# EasyEDA Pro project boost_0.8V_to_3.3V_v0.1.eprj

# Schematic Schematic1
Create Date: 2023-07-08; Page Name: P1; Project Name: BuckBoost 1V to 3.3V v0.1; Schematic Name: Schematic1; Update Date: 2023-07-08; Company: EasyEDA.com; Drawed: EasyEDA Pro; Page Size: A4; Part Number: JLCPCB-002; Reviewed: EasyEDA Pro; Version: V0.1
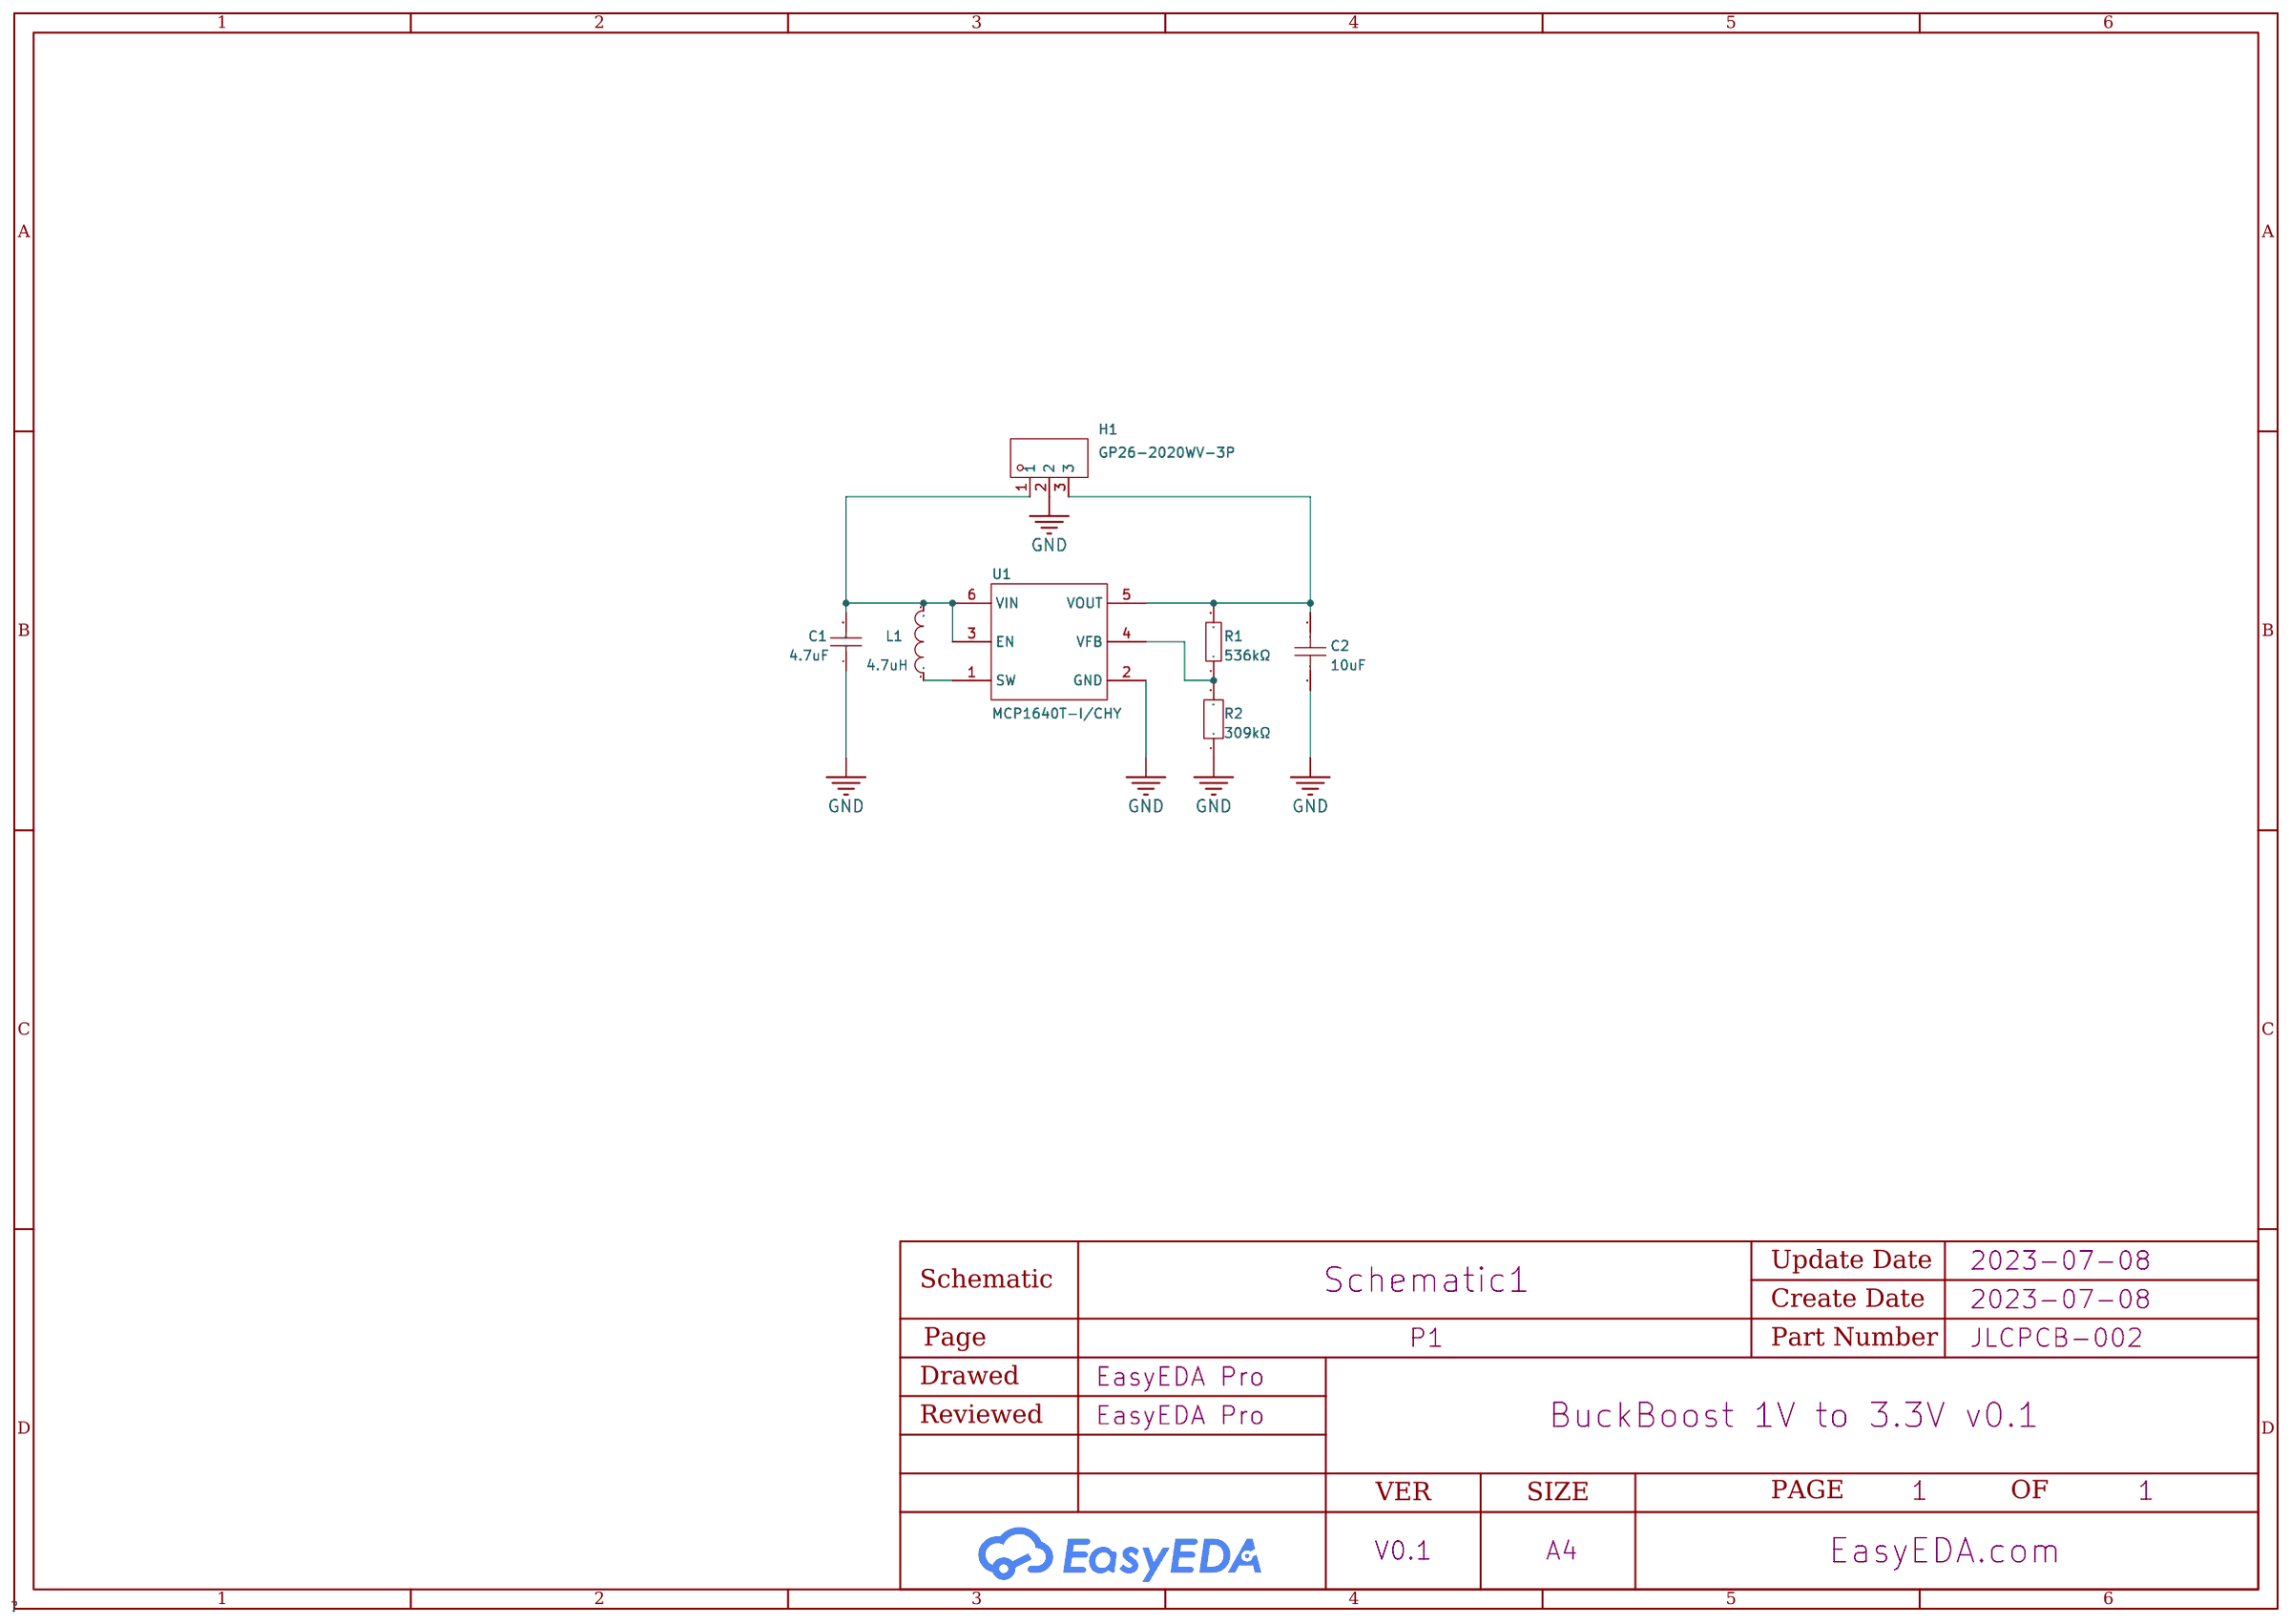
[diagram p0: schematic sheet]

## Parts
C1  4.7uF  [C0603]
C2  10uF  [C0603]
H1  GP26-2020WV-3P  [HDR-TH_3P-P2.00-V-M]
L1  4.7uH  [IND-SMD_L2.5-W1.8]
R1  536kΩ  [R0603]
R2  309kΩ  [R0603]
U1  MCP1640T-I/CHY  [SOT-23-6_L2.9-W1.6-P0.95-LS2.8-BR]

## Library data of the parts
C1 = CL10A475KO8NNNC: Capacitance: Tolerance:±10% Tolerance:±10% Voltage Rated: Temperature Coefficient:; LCSC Part Name: 4.7uF ±10% 16V; Supplier Part: C19666; Manufacturer: SAMSUNG(三星); Supplier Footprint: 0603; JLCPCB Part Class: Basic Part; Datasheet: https://atta.szlcsc.com/upload/public/pdf/source/20160103/1457707703134.pdf; Supplier: LCSC; Tolerance: ±10%
C2 = CL10A106KP8NNNC: Capacitance: Tolerance:±10% Tolerance:±10% Voltage Rated: Temperature Coefficient:; LCSC Part Name: 10uF ±10% 10V; Supplier Part: C19702; Manufacturer: SAMSUNG(三星); Supplier Footprint: 0603; JLCPCB Part Class: Basic Part; Datasheet: https://atta.szlcsc.com/upload/public/pdf/source/20160103/1457707703378.pdf; Supplier: LCSC; Tolerance: ±10%
H1 = GP26-2020WV-3P: Number of Rows:Plugin Number of Pins:3P Pitch:2mm Pin Structure:1x3P Row Spacing:- Mounting Type:Straight Circluar Pins/Square Pins:Square Pins Current Rating (Max):1A Voltage Rating (Max):- Length of Mating Pin:4mm Insulation Height:2mm Length of End Con; LCSC Part Name: 2mm 1x3P 直插 方针; Supplier Part: C2681735; Manufacturer: GEPU(歌普); Supplier Footprint: 插件,P=2mm; JLCPCB Part Class: Extended Part; Datasheet: https://atta.szlcsc.com/upload/public/pdf/source/20220307/48341396017B62D534E3FCD9CD4F77BA.pdf; Supplier: LCSC; Number of Rows: Plugin; Number of Pins: 3P; Pitch: 2mm; Pin Structure: 1x3P; Mounting Type: Straight; Circluar Pins/Square Pins: Square Pins; Current Rating (Max): 1A; Length of Mating Pin: 4mm; Insulation Height: 2mm; Length of End Connection Pin: 3mm; Operating Temperature Range: -40~+105; Color: Black
L1 = CBC2518T4R7M: Type:- Inductance: Tolerance:±20% Tolerance:±20% Rated Current: Saturation Current (Isat):680mA DC Resistance (DCR): Ratings:-; LCSC Part Name: 4.7uH ±20% 680mA; Supplier Part: C268002; Manufacturer: TAIYO YUDEN(太诱); Supplier Footprint: SMD; JLCPCB Part Class: Extended Part; Datasheet: https://atta.szlcsc.com/upload/public/pdf/source/20180820/C268002_0E22732304EF0852B3951C6629BBBAB5.pdf; Supplier: LCSC; Tolerance: ±20%; Saturation Current (Isat): 680mA
R1 = RTT035363FTP: Type:Thick Film Resistors Resistance: Tolerance:±1% Tolerance:±1% Power(Watts): Temperature Coefficient:±100ppm/ Temperature Coefficient:±100ppm/ Overload Voltage (Max): Operating Temperature Range:-55~+155 Operating Temperature Range:-55~+155; LCSC Part Name: 536kΩ ±1% 100mW; Supplier Part: C13243; Manufacturer: RALEC(旺诠); Supplier Footprint: 0603; JLCPCB Part Class: Extended Part; Datasheet: https://atta.szlcsc.com/upload/public/pdf/source/20140224/1457706960797.pdf; Supplier: LCSC; Type: Thick Film Resistors; Tolerance: ±1%; Temperature Coefficient: ±100ppm/; Operating Temperature Range: -55~+155
R2 = TD03G3093BT: Resistance: Tolerance: Temperature Coefficient: Temperature Coefficient: Power(Watts): Overload Voltage (Max): Operating Temperature Range: Operating Temperature Range:; LCSC Part Name: 309KΩ(3093) ±0.1%; Supplier Part: C667201; Manufacturer: FH(风华); Supplier Footprint: 0603; JLCPCB Part Class: Extended Part; Datasheet: https://atta.szlcsc.com/upload/public/pdf/source/20181211/C347100_9EFE94D77969634609276CBD120ED731.pdf; Supplier: LCSC
U1 = MCP1640T-I/CHY: Function:Boost type Synchronous Rectification:Yes Number of Outputs:1 Topology:Boost Input Voltage:0.8V~5.5V Input Voltage:0.8V~5.5V Output Voltage:2V~5.5V Output Voltage:2V~5.5V Output Current (Max):350mA Switching Frequency:500kHz; LCSC Part Name: 升压型 Vin=0.8V~5.5V Vout=2V~5.5V 350mA; Supplier Part: C44365; Manufacturer: MICROCHIP(美国微芯); Supplier Footprint: SOT-23-6; JLCPCB Part Class: Extended Part; Datasheet: https://atta.szlcsc.com/upload/public/pdf/source/20150319/1457707270677.pdf; Supplier: LCSC; Function: Boost type; Synchronous Rectification: Yes; Number of Outputs: 1; Topology: Boost; Input Voltage: 0.8V~5.5V; Output Voltage: 2V~5.5V; Output Current (Max): 350mA; Switching Frequency: 500kHz

## Nets
GND: C1.1 C2.1 H1.2 R2.1 U1.2(GND)
$1N300: C1.2 H1.1 L1.2 U1.3(EN) U1.6(VIN)
$1N303: L1.1 U1.1(SW)
$1N772: C2.2 H1.3 R1.2 U1.5(VOUT)
$1N1083: R1.1 R2.2 U1.4(VFB)

# Board PCB1
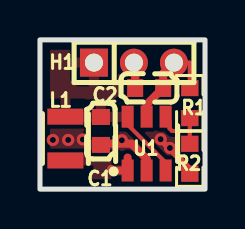
[diagram p1: board, top side]
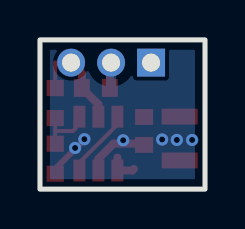
[diagram p2: board, bottom side, seen from below]

Outline 8.25 x 7.49 mm; copper layers: Top Layer, Bottom Layer. Coordinates in mm from the lower left corner of the outline.
Outline path: rectangle 0,7.49 8.25,0
Stack: Top Layer 0.035mm / Dielectric1 1.51mm FR4 er 4.5 / Bottom Layer 0.035mm

## Design rules (mm)
spacing safeClearance (default): track to track 0.152, other pairs 0.152 to 0.3
track width trackWidth (default): min 0.127, default 0.254, max 2.54
differential pair differentialPair (default): width min 0.127, default 0.254, max 2.54; gap min 0.152, default 0.152
via viaSize (default): diameter min 0.5, default 0.61, max 10; hole min 0.3, default 0.305, max 6
net $1N300 uses copperRegion1
net GND uses copperRegion1
net $1N303 uses copperRegion1
net $1N772 uses copperRegion1

## Placement (name value [footprint] x y rotation side)
C1  4.7uF  [C0603]  3.05 2.92 90 top
C2  10uF  [C0603]  5.46 5.08 0 top
H1  GP26-2020WV-3P  [HDR-TH_3P-P2.00-V-M]  4.7 6.35 0 top
L1  4.7uH  [IND-SMD_L2.5-W1.8]  1.27 2.54 90 top
R1  536kΩ  [R0603]  7.49 4.32 90 top
R2  309kΩ  [R0603]  7.49 1.52 90 top
U1  MCP1640T-I/CHY  [SOT-23-6_L2.9-W1.6-P0.95-LS2.8-BR]  5.33 2.29 270 top

## Footprints (pads in the part's own frame, mm; a bottom-side part is the same pattern mirrored in y, then rotated)
C0603
  rect 0.8x0.9 smd: 1(-0.7,0) 2(0.7,0)
HDR-TH_3P-P2.00-V-M
  rect 1.4x1.4 hole 0.9: 1(-2,0)
  round 1.4 hole 0.9: 2(0,0) 3(2,0)
IND-SMD_L2.5-W1.8
  rect 0.8x1.8 smd: 1(-1.1,0) 2(1.1,0)
R0603
  rect 0.806x0.864 smd: 1(-0.753,0) 2(0.753,0)
SOT-23-6_L2.9-W1.6-P0.95-LS2.8-BR
  rect 1.1x0.6 smd: 1(1.35,-0.95) 2(1.35,0) 3(1.35,0.95) 4(-1.35,0.95) 5(-1.35,0) 6(-1.35,-0.95)

## Nets
As in the schematic.

## Via types
v1: diameter 0.61, hole 0.305, Top Layer to Bottom Layer, 6 vias

## Routing (per net, layer and track width the routed paths; a pad name or vN(x,y) marks a point on that pad's centre or on a via; arc(x,y) is an arc through that point)
GND: length 6.6
  Top Layer w0.3: 6.22,2.29 7.49,1.02 R2.1
  Top Layer w0.4: U1.2 5.33,1.52 4.57,2.29 3.11,2.29 C1.1 ; 4.76,5.08 4.76,6.29 H1.2
  vias: v1(0.65,2.47) v1(1.41,2.47) v1(2.15,2.49) v1(4.09,2.45) v1(6.04,2.51) v1(6.5,2.07)
$1N300: length 3.5
  Top Layer w0.2: U1.6 4.44,3.58 4.44,3.17 6.28,1.34 U1.3
$1N303: length 1.5
  Top Layer w0.4: 4.38,1.58 U1.1 3.64,0.94 3.56,1.02
$1N772: length 5.4
  Top Layer w0.2: R1.2 7.49,6.35 H1.3
  Top Layer w0.4: U1.5 5.33,4.25 C2.2 6.16,5.81 H1.3
$1N1083: length 3
  Top Layer w0.2: R1.1 7.49,2.92 ; 7.49,2.92 R2.2 ; 7.49,2.92 6.61,2.92 6.48,3.05 6.48,3.44 U1.4

## Copper pours and planes (outline as drawn; the poured copper is in the pictures)
GND on Top Layer: 0,3.05 0,1.91 4.7,1.91 4.7,0 8.25,0 8.25,3.05
GND on Bottom Layer: 0,7.49 8.25,7.49 8.25,0 0,0
$1N300 on Top Layer: 0,7.49 4.7,7.49 4.7,3.09 0,3.09
$1N303 on Top Layer: 0,1.82 4.54,1.82 4.54,0 0,0
$1N772 on Top Layer: 4.95,7.49 6.85,7.49 6.85,3.05 4.95,3.05
